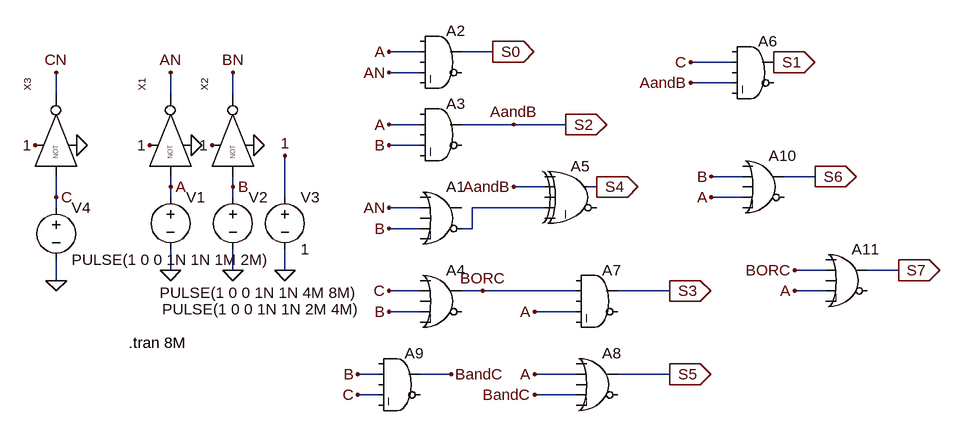
[diagram p0: schematic DECODER_LAB_2.asc]
DECODER_LAB_2.asc, the LTspice schematic file:
Version 4
SHEET 1 1320 680
WIRE 176 -48 128 -48
WIRE 288 -48 240 -48
WIRE 656 -32 592 -32
WIRE 176 -16 128 -16
WIRE 656 0 592 0
WIRE -384 16 -384 -16
WIRE -208 16 -208 -16
WIRE -112 16 -112 -16
WIRE 176 64 128 64
WIRE 320 64 240 64
WIRE 400 64 320 64
WIRE 176 96 128 96
WIRE 672 144 624 144
WIRE 784 144 736 144
WIRE -208 160 -208 144
WIRE -112 160 -112 144
WIRE 368 160 320 160
WIRE 448 160 432 160
WIRE -384 176 -384 144
WIRE -208 176 -208 160
WIRE -112 176 -112 160
WIRE -32 176 -32 112
WIRE 672 176 624 176
WIRE -384 192 -384 176
WIRE 176 192 128 192
WIRE 368 192 256 192
WIRE 176 224 128 224
WIRE 256 224 256 192
WIRE 256 224 240 224
WIRE -208 288 -208 256
WIRE -112 288 -112 256
WIRE -32 288 -32 256
WIRE 800 288 752 288
WIRE 912 288 864 288
WIRE -384 304 -384 272
WIRE 176 320 128 320
WIRE 272 320 240 320
WIRE 416 320 272 320
WIRE 560 320 480 320
WIRE 800 320 752 320
WIRE 176 352 128 352
WIRE 416 352 352 352
WIRE 112 448 80 448
WIRE 224 448 176 448
WIRE 416 448 352 448
WIRE 560 448 480 448
WIRE 112 480 80 480
WIRE 416 480 352 480
FLAG -80 96 0
FLAG -32 288 0
FLAG -112 288 0
FLAG -208 288 0
FLAG -240 96 1
FLAG -32 112 1
FLAG -144 96 1
FLAG -112 160 B
FLAG -208 160 A
FLAG -208 -16 AN
FLAG -112 -16 BN
FLAG 128 -48 A
FLAG 128 -16 AN
FLAG 128 64 A
FLAG 128 96 B
FLAG 128 192 AN
FLAG 128 224 B
FLAG 128 320 C
FLAG 128 352 B
FLAG 560 320 S3
IOPIN 560 320 Out
FLAG 448 160 S4
IOPIN 448 160 Out
FLAG 720 -32 S1
IOPIN 720 -32 Out
FLAG 288 -48 S0
IOPIN 288 -48 Out
FLAG -176 96 0
FLAG -384 176 C
FLAG -384 -16 CN
FLAG -416 96 1
FLAG -352 96 0
FLAG -384 304 0
FLAG 592 -32 C
FLAG 352 352 A
FLAG 320 64 AandB
FLAG 592 0 AandB
FLAG 320 160 AandB
FLAG 272 320 BORC
FLAG 352 480 BandC
FLAG 352 448 A
FLAG 560 448 S5
IOPIN 560 448 Out
FLAG 80 448 B
FLAG 80 480 C
FLAG 224 448 BandC
FLAG 400 64 S2
IOPIN 400 64 Out
FLAG 624 144 B
FLAG 624 176 A
FLAG 784 144 S6
IOPIN 784 144 Out
FLAG 912 288 S7
IOPIN 912 288 Out
FLAG 752 288 BORC
FLAG 752 320 A
SYMBOL voltage -208 160 R0
WINDOW 3 -17 163 Left 2
WINDOW 123 0 0 Left 0
WINDOW 39 0 0 Left 0
SYMATTR Value PULSE(1 0 0 1N 1N 4M 8M)
SYMATTR InstName V1
SYMBOL voltage -112 160 R0
WINDOW 3 -109 188 Left 2
WINDOW 123 0 0 Left 0
WINDOW 39 0 0 Left 0
SYMATTR Value PULSE(1 0 0 1N 1N 2M 4M)
SYMATTR InstName V2
SYMBOL voltage -32 160 R0
WINDOW 123 0 0 Left 0
WINDOW 39 0 0 Left 0
SYMATTR InstName V3
SYMATTR Value 1
SYMBOL NOT4 -192 80 R270
SYMATTR InstName X1
SYMBOL NOT4 -96 80 R270
SYMATTR InstName X2
SYMBOL Digital\\or 208 144 R0
SYMATTR InstName A1
SYMBOL Digital\\and 208 -96 R0
SYMATTR InstName A2
SYMBOL Digital\\and 208 16 R0
SYMATTR InstName A3
SYMBOL Digital\\or 208 272 R0
SYMATTR InstName A4
SYMBOL Digital\\xor 416 112 R0
SYMATTR InstName A5
SYMBOL voltage -384 176 R0
WINDOW 123 0 0 Left 0
WINDOW 39 0 0 Left 0
SYMATTR InstName V4
SYMATTR Value PULSE(1 0 0 1N 1N 1M 2M)
SYMBOL NOT4 -368 80 R270
SYMATTR InstName X3
SYMBOL Digital\\and 688 -80 R0
SYMATTR InstName A6
SYMBOL Digital\\and 448 272 R0
SYMATTR InstName A7
SYMBOL Digital\\and 144 400 R0
SYMATTR InstName A9
SYMBOL Digital\\or 448 400 R0
SYMATTR InstName A8
SYMBOL Digital\\or 704 96 R0
SYMATTR InstName A10
SYMBOL Digital\\or 832 240 R0
SYMATTR InstName A11
TEXT -272 400 Left 2 !.tran 8M

The netlist it stands for:
* DECODER_LAB_2.asc
V1 A 0 PULSE(1 0 0 1N 1N 4M 8M)
V2 B 0 PULSE(1 0 0 1N 1N 2M 4M)
V3 1 0 1
XX1 A 1 0 AN NOT4  ; pins A VH VL OUT
XX2 B 1 0 BN NOT4  ; pins A VH VL OUT
A1 0 AN 0 B 0 N001 0 0 OR
A2 0 A 0 AN 0 0 S0 0 AND
A3 0 A 0 B 0 0 S2 0 AND
A4 0 C 0 B 0 0 BORC 0 OR
A5 0 S2 0 N001 0 0 S4 0 XOR
V4 C 0 PULSE(1 0 0 1N 1N 1M 2M)
XX3 C 1 0 CN NOT4  ; pins A VH VL OUT
A6 0 C 0 S2 0 0 S1 0 AND
A7 0 BORC 0 A 0 0 S3 0 AND
A9 0 B 0 C 0 0 BandC 0 AND
A8 0 A 0 BandC 0 0 S5 0 OR
A10 0 B 0 A 0 0 S6 0 OR
A11 0 BORC 0 A 0 0 S7 0 OR
.tran 8M
.backanno
.end